# Altium project PHANTOM_VCU.PrjPcb (part 3 of 3)

## Sheet CAN.SchDoc
size A4; DocumentNumber: 6; SheetNumber: 6; SheetTotal: 8
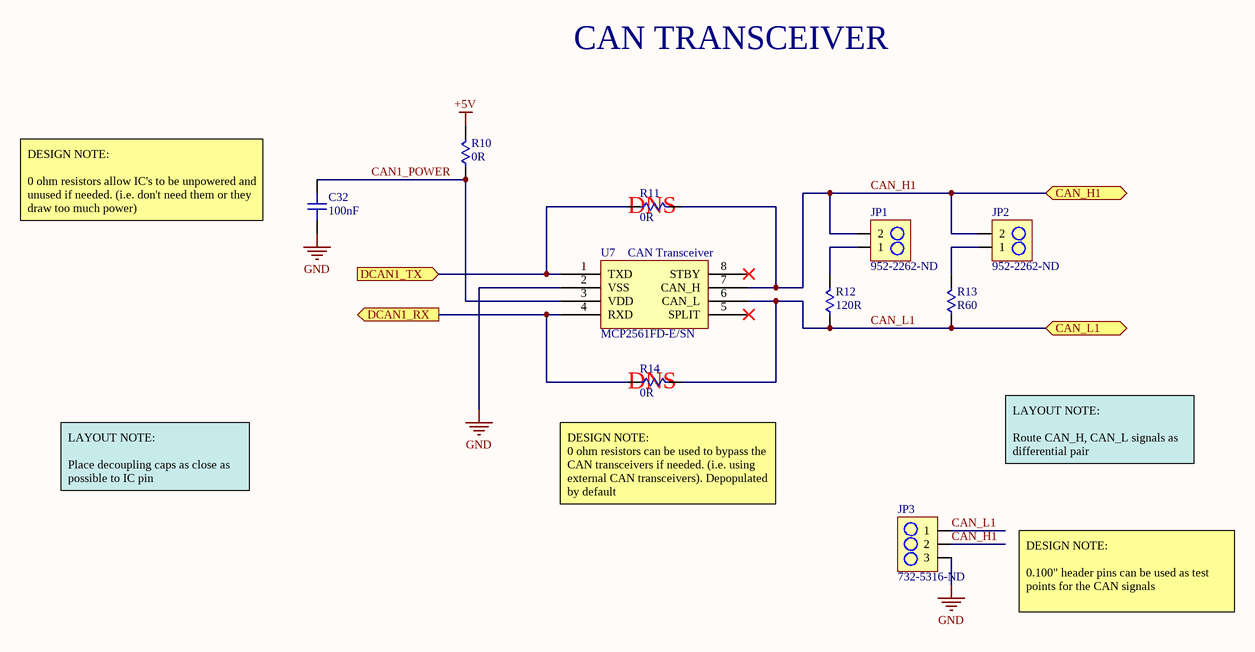
[diagram p6: CAN.SchDoc]

### Parts
C32  100nF  [C0402]
JP1  952-2262-ND  [2PIN_HEADER]
JP2  952-2262-ND  [2PIN_HEADER]
JP3  732-5316-ND  [3PIN_HEADER]
R10  0R  [R0402]
R11  0R  [R0402]
R12  120R  [R0402]
R13  R60  [R0402]
R14  0R  [R0402]
U7  MCP2561FD-E/SN  [8-SOIC_MCP2561]

### Ports
CAN_H1, CAN_L1, DCAN1_RX, DCAN1_TX

### Nets
+5V: R10.2
GND: C32.1 JP3.3 U7.2(VSS)
CAN1_POWER: C32.2 R10.1 U7.3(VDD)
CAN_H1: JP1.2 JP2.2 JP3.2 R11.2 U7.7(CAN_H) ; port CAN_H1
CAN_L1: JP3.1 R12.1 R13.1 R14.2 U7.6(CAN_L) ; port CAN_L1
DCAN1_RX: R14.1 U7.4(RXD) ; port DCAN1_RX
DCAN1_TX: R11.1 U7.1(TXD) ; port DCAN1_TX
NetJP1_1: JP1.1 R12.2
NetJP2_1: JP2.1 R13.2

Not connected (* = marked no-connect by the designer): U7 5(SPLIT)* 8(STBY)*

### Notes on the sheet
- CAN TRANSCEIVER
- DESIGN NOTE:
  0 ohm resistors allow IC's to be unpowered and unused if needed. (i.e. don't need them or they draw too much power)
- (near R11) DNS
- (near U7) CAN Transceiver
- (near R14) DNS
- LAYOUT NOTE:
  Place decoupling caps as close as possible to IC pin
- LAYOUT NOTE:
  Route CAN_H, CAN_L signals as differential pair
- (near R14) DESIGN NOTE:
  0 ohm resistors can be used to bypass the CAN transceivers if needed. (i.e. using external CAN transceivers). Depopulated by default
- DESIGN NOTE:
  0.100" header pins can be used as test points for the CAN signals

### Library data of the parts
C32 = CL05A104MP5NNNC: CAP MLCC 0.1uF 10V X5R 0402 20% SMD 0402 85C Paper T/R; Manufacturer: Samsung; Supplier 1: Digi-Key; Manufacturer Part Number: CL05A104MP5NNNC; Stock 1: 100000; Pricing 1: 1=0.1, 10=0.024, 100=0.0106, 500=0.0076, 1000=0.006, 2500=0.0054, 5000=0.005 (USD); Mount: Surface Mount; Case/Package: 0402; Case Code (Metric): 1005; Case Code (Imperial): 0402; Min Operating Temperature: -55°C; Max Operating Temperature: 85°C; Packaging: Tape and Reel; Capacitance: 100nF; Tolerance: 20%; Voltage Rating: 10V; Dielectric: X5R; Voltage Rating (DC): 10V; Length: 1mm; Height: 0.5mm; Width: 0.02inch; Thickness: 0.022inch; Depth: 0.5mm; Radiation Hardening: No; Lead Free: Lead Free; ComponentLink1URL: https://media.digikey.com/pdf/Data%20Sheets/Samsung%20PDFs/CL_Series_MLCC_ds.pdf; ComponentLink1Description: https://media.digikey.com/pdf/Data%20Sheets/Samsung%20PDFs/CL_Series_MLCC_ds.pdf; Supplier Part Number 1: 1276-1443-1-ND
JP1 JP2 = M20-9990246: CONN_HeaderPins2pos Headers & Wire Housings 02 SIL VERTICAL PIN HEADER TIN; Manufacturer: Harwin; Contact Resistance: 30mR; Max Current Rating: 3A; Number of Positions: 2; Gender: Male; Connector Type: Male Pin; Insulation Resistance: 10GR; Voltage Rating (AC): 750V; Pitch: 2.54mm; Supplier 1: Digi-Key; Manufacturer Part Number: M20-9990246; Stock 1: 53577; Pricing 1: 1=0.11, 10=0.099, 100=0.0609, 500=0.0504, 1000=0.0441, 5000=0.0378, 10000=0.0368 (USD); Case/Package: SIL; Colour: Black; Housing Colour: Black; Housing Material: Nylon; Contact Plating: Tin; Contact Material: Bronze,Brass; Min Operating Temperature: -40°C; Max Operating Temperature: 105°C; Package Quantity: 1000; Packaging: Bulk; Termination: Solder; Number of Rows: 1; Number of Contacts: 2; Orientation: Straight; Current Rating: 3A; Length: 5.08mm; Depth: 2.54mm; Contact Mating Length: 0.24inch; Radiation Hardening: No; REACH SVHC: No SVHC; ComponentLink1URL: https://datasheet.ciiva.com/8046/315376-8046930.pdf; ComponentLink1Description: https://datasheet.ciiva.com/8046/315376-8046930.pdf; ComponentLink2URL: https://datasheet.ciiva.com/6833/m20-999-6833368.pdf; ComponentLink2Description: https://datasheet.ciiva.com/6833/m20-999-6833368.pdf; ComponentLink3URL: https://datasheet.ciiva.com/11745/0900766b81034e61-11745755.pdf; ComponentLink3Description: https://datasheet.ciiva.com/11745/0900766b81034e61-11745755.pdf; ComponentLink4URL: https://datasheet.ciiva.com/22660/1830818-22660571.pdf; ComponentLink4Description: https://datasheet.ciiva.com/22660/1830818-22660571.pdf; ComponentLink5URL: https://datasheet.ciiva.com/26852/getdatasheetpartid-384170-26852203.pdf; ComponentLink5Description: https://datasheet.ciiva.com/26852/getdatasheetpartid-384170-26852203.pdf; Supplier Part Number 1: 952-2262-ND
JP3 = 61300311121: CONN_HeaderPins3pos WURTH ELEKTRONIK Board-To-Board Connector, Vertical, WR-PHD Series, Through Hole, Header, 3 Contacts, 2.54 mm; Manufacturer: Wurth Electronics; Number of Positions: 3; Gender: Male; Connector Type: Male Pin; Pitch: 0.1inch; Supplier 1: Digi-Key; Manufacturer Part Number: 61300311121; Stock 1: 57026; Pricing 1: 1=0.13, 10=0.106, 25=0.088, 50=0.074, 100=0.067, 1000=0.061 (USD); Mount: Through Hole; Case/Package: 100; Contact Plating: Gold; Contact Material: Copper; Colour: Black; Number of Rows: 1; Packaging: Bulk; Termination: Solder; Number of Contacts: 3; Contact Mating Length: 0.236inch; REACH SVHC: Unknown; Lead Free: Lead Free; ComponentLink1URL: http://www.farnell.com/cad/1737268.pdf; ComponentLink1Description: http://www.farnell.com/cad/1737268.pdf; Supplier Part Number 1: 732-5316-ND
R10 R11 R14 = RC0402JR-070RL: RES SMD 0 OHM 1/16W 0402; Manufacturer: Yageo; Resistance: 0mR; Power Rating: 62.5mW; Tolerance: 5%; Voltage Rating: 50V; Max Power Dissipation: 63mW; Temperature Coefficient: 200ppm/°C; Supplier 1: Digi-Key; Manufacturer Part Number: RC0402JR-070RL; Stock 1: 44333412; Pricing 1: 1=0.1, 10=0.017, 25=0.0124, 50=0.0096, 100=0.007, 250=0.0054, 500=0.0043, 1000=0.0032, 5000=0.0023 (USD); Case/Package: 0402; Contact Plating: Matte,Tin; Case Code (Metric): 1005; Case Code (Imperial): 0402; Min Operating Temperature: -55°C; Max Operating Temperature: 155°C; Packaging: Tape and Reel; Composition: Thick Film; Package Quantity: 1; Number of Terminations: 2; Termination: SMD/SMT; Military Standard: Not; Features: Moisture Resistant; Length: 1mm; Height: 0.016inch; Width: 0.02inch; Depth: 0.5mm; Radiation Hardening: No; REACH SVHC: Unknown; Lead Free: Lead Free; Supplier Part Number 1: 311-0.0JRCT-ND
R12 = RMCF0402JT120R: RES SMD 120 OHM 5% 0402 1/16W ±100ppm/C Molded SMD Paper T/R; Manufacturer: Stackpole Electronics; Power Rating: 62.5mW; Max Power Dissipation: 63mW; Temperature Coefficient: 100ppm/°C; Supplier 1: Digi-Key; Manufacturer Part Number: RMCF0402JT120R; Stock 1: 112024; Pricing 1: 1=0.1, 10=0.012, 100=0.005, 1000=0.0022, 2500=0.002, 5000=0.0016 (USD); Mount: Surface Mount; Case/Package: 0402; Case Code (Metric): 1005; Case Code (Imperial): 0402; Contact Plating: Matte,Tin; Min Operating Temperature: -55°C; Max Operating Temperature: 155°C; Tolerance: 5%; Packaging: Cut Tape; Resistance: 120R; Composition: Thick Film; Number of Terminations: 2; Features: Automotive AEC-Q200; Length: 0.039inch; Height: 0.016inch; Width: 0.02inch; Lead Free: Lead Free; Supplier Part Number 1: RMCF0402JT120RCT-ND
R13 = RMCF0402FT60R4: RES SMD 60.4 OHM 1% 0402 1/16W 100ppm/C Molded SMD SMD Paper T/R; Manufacturer: Stackpole Electronics; Resistance: 60.4R; Max Power Dissipation: 63mW; Temperature Coefficient: 100ppm/°C; Supplier 1: Digi-Key; Manufacturer Part Number: RMCF0402FT60R4; Stock 1: 29830; Pricing 1: 1=0.1, 10=0.016, 100=0.0064, 1000=0.0029, 2500=0.0025, 5000=0.0021 (USD); Mount: Surface Mount; Case/Package: 0402; Case Code (Metric): 1005; Case Code (Imperial): 0402; Contact Plating: Matte,Tin; Min Operating Temperature: -55°C; Max Operating Temperature: 155°C; Packaging: Tape and Reel; Tolerance: 1%; Composition: Thick Film; Number of Terminations: 2; Features: Automotive AEC-Q200; Length: 0.039inch; Height: 0.016inch; Width: 0.02inch; Radiation Hardening: No; Lead Free: Lead Free; Supplier Part Number 1: RMCF0402FT60R4CT-ND
U7 = MCP2561FD-E/SN: IC CAN Bus, Transceiver, CAN, 1, 1, 4.5 V, 5.5 V, SOIC; Manufacturer: Microchip; Number of Receivers: 1; Data Rate: 8Mbps; Min Supply Voltage: 4.5V; Max Supply Voltage: 5.5V; Max Supply Current: 70mA; Receiver Hysteresis: 200mV; Supplier 1: Digi-Key; Manufacturer Part Number: MCP2561FD-E/SN; Stock 1: 1072; Pricing 1: 1=0.97, 25=0.8084, 100=0.735 (USD); Case/Package: SOIC; Number of Pins: 8; Weight: 0.019048oz; Min Operating Temperature: -40°C; Max Operating Temperature: 125°C; Packaging: Rail/Tube; Number of Transceivers: 1; Logic Function: Transceiver; Interface: CAN; Number of Drivers: 1; Number of Transmit Buffers: 1; Number of Receive Buffers: 1; Operating Supply Current: 70mA; Package Quantity: 100; Length: 4.9mm; Height: 1.5mm; Width: 3.9mm; REACH SVHC: No SVHC; Lead Free: Lead Free; ComponentLink1URL: https://datasheet.ciiva.com/48512/mcp2561fd-eng-tds-48512069.pdf; ComponentLink1Description: https://datasheet.ciiva.com/48512/mcp2561fd-eng-tds-48512069.pdf; ComponentLink2URL: https://datasheet.ciiva.com/46406/1821190-46406024.pdf; ComponentLink2Description: https://datasheet.ciiva.com/46406/1821190-46406024.pdf; ComponentLink3URL: https://datasheet.ciiva.com/46406/1821190-46406056.pdf; ComponentLink3Description: https://datasheet.ciiva.com/46406/1821190-46406056.pdf; ComponentLink4URL: https://datasheet.ciiva.com/48473/20005284a-48473177.pdf; ComponentLink4Description: https://datasheet.ciiva.com/48473/20005284a-48473177.pdf

## Sheet Contactor_Switching.SchDoc
size A4; DocumentNumber: 7; SheetNumber: 7; SheetTotal: 8
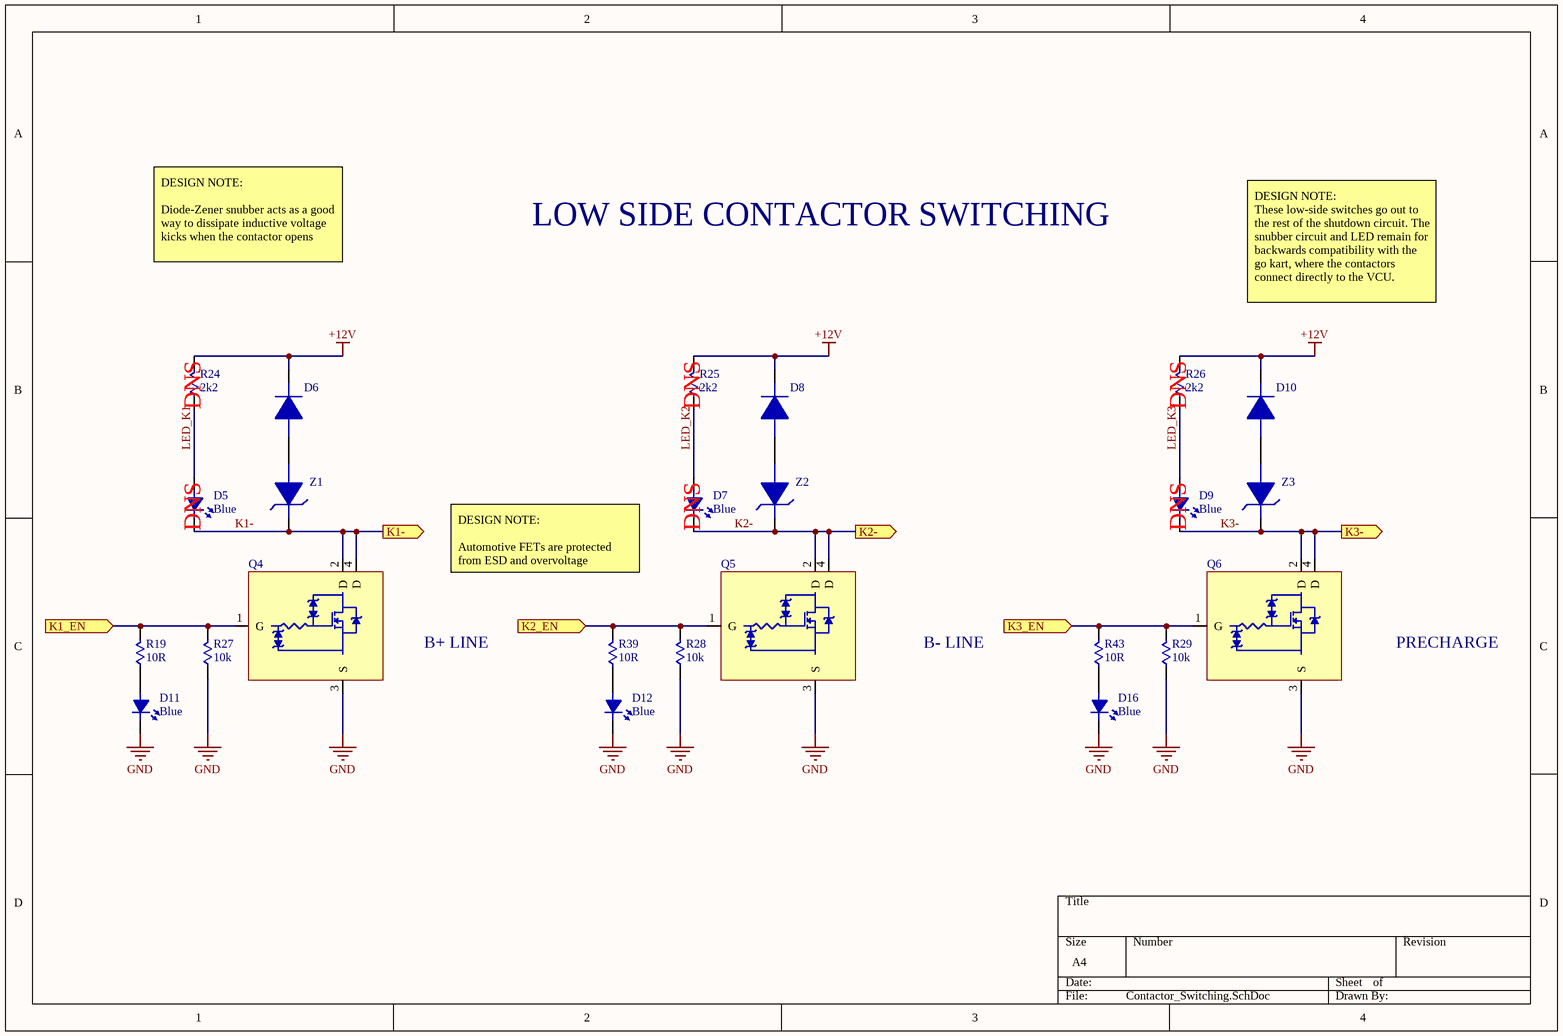
[diagram p7: Contactor_Switching.SchDoc]

### Parts
(Parts that share a designator on the sheet are numbered #1, #2 ... from top to bottom, then left to right.)
D5  Blue  [LED_0603]
D6  S3BB-TP  [DO-214AA_Diode]  (value not drawn)
D7  Blue  [LED_0603]
D8  S3BB-TP  [DO-214AA_Diode]  (value not drawn)
D9  Blue  [LED_0603]
D10  S3BB-TP  [DO-214AA_Diode]  (value not drawn)
D11  Blue  [LED_0603]
D12  Blue  [LED_0603]
D16  Blue  [LED_0603]
Q4  NCV8406ASTT1G  [SOT-223_NFET]  (value not drawn)
Q5  NCV8406ASTT1G  [SOT-223_NFET]  (value not drawn)
Q6  NCV8406ASTT1G  [SOT-223_NFET]  (value not drawn)
R19  10R  [R0402]
R24  2k2  [R0402]
R25  2k2  [R0402]
R26  2k2  [R0402]
R27  10k  [R0402]
R28  10k  [R0402]
R29  10k  [R0402]
R39#1  10R  [R0402]
R43#1  10R  [R0402]
Z1  12V  [DO-214AA_Diode]  (value not drawn)
Z2  12V  [DO-214AA_Diode]  (value not drawn)
Z3  12V  [DO-214AA_Diode]  (value not drawn)

### Ports
K1-, K1_EN, K2-, K2_EN, K3-, K3_EN

### Nets
+12V: D6.2 D8.2 D10.2 R24.2 R25.2 R26.2
GND: D11.2 D12.2 D16.2 Q4.3(S) Q5.3(S) Q6.3(S) R27.1 R28.1 R29.1
K1-: D5.2 Q4.2(D) Q4.4(D) Z1.2 ; port K1-
K1_EN: Q4.1(G) R19.2 R27.2 ; port K1_EN
K2-: D7.2 Q5.2(D) Q5.4(D) Z2.2 ; port K2-
K2_EN: Q5.1(G) R28.2 R39#1.2 ; port K2_EN
K3-: D9.2 Q6.2(D) Q6.4(D) Z3.2 ; port K3-
K3_EN: Q6.1(G) R29.2 R43#1.2 ; port K3_EN
LED_K1: D5.1 R24.1
LED_K2: D7.1 R25.1
LED_K3: D9.1 R26.1
NetD6_1: D6.1 Z1.1
NetD8_1: D8.1 Z2.1
NetD10_1: D10.1 Z3.1
NetD11_1: D11.1 R19.1
NetD12_1: D12.1 R39#1.1
NetD16_1: D16.1 R43#1.1

### Notes on the sheet
- LOW SIDE CONTACTOR SWITCHING
- DESIGN NOTE:
  Diode-Zener snubber acts as a good way to dissipate inductive voltage kicks when the contactor opens
- DESIGN NOTE:
  These low-side switches go out to the rest of the shutdown circuit. The snubber circuit and LED remain for backwards compatibility with the go kart, where the contactors connect directly to the VCU.
- (near R24) DNS
- (near R25) DNS
- (near R26) DNS
- (near D5) DNS
- DESIGN NOTE:
  Automotive FETs are protected from ESD and overvoltage
- (near D7) DNS
- (near D9) DNS
- B+ LINE
- B- LINE
- PRECHARGE

### Library data of the parts
D5 D7 D9 D11 D12 D16 = 150060BS75000: LED BLUE CLEAR 0603 SMD 3.2V 145MCD, 470NM; Manufacturer: Wurth Electronics; Forward Current: 30mA; Viewing Angle: 140°; Lens Style: Clear,Rectangular; Test Current: 20mA; Supplier 1: Digi-Key; Manufacturer Part Number: 150060BS75000; Stock 1: 59667; Pricing 1: 1=0.15, 50=0.141, 100=0.121, 500=0.104 (USD); Mount: Surface Mount; Case/Package: 0603; Color: Blue; Case Code (Metric): 1608; Case Code (Imperial): 0603; Min Operating Temperature: -40°C; Max Operating Temperature: 85°C; Luminous Intensity: 145mcd; Forward Voltage: 3.2V; Wavelength: 470nm; Package Quantity: 4000; Packaging: Cut Tape; Dominant Wavelength: 470nm; Length: 1.6mm; Height: 0.7mm; Width: 0.8mm; REACH SVHC: Unknown; ComponentLink1URL: https://www.distrelec.biz/Web/Downloads/_t/ds/150060BS75000_eng_tds.pdf?mime=application%2Fpdf; ComponentLink1Description: https://www.distrelec.biz/Web/Downloads/_t/ds/150060BS75000_eng_tds.pdf?mime=application%2Fpdf; ComponentLink2URL: https://katalog.we-online.de/led/datasheet/150060BS75000.pdf; ComponentLink2Description: https://katalog.we-online.de/led/datasheet/150060BS75000.pdf; ComponentLink3URL: http://www.farnell.com/datasheets/1911343.pdf; ComponentLink3Description: http://www.farnell.com/datasheets/1911343.pdf; ComponentLink4URL: http://www.produktinfo.conrad.com/datenblaetter/750000-774999/759426-da-01-en-CHIPLED_0603_W_KL_BLAU_150060BS75000.pdf; ComponentLink4Description: http://www.produktinfo.conrad.com/datenblaetter/750000-774999/759426-da-01-en-CHIPLED_0603_W_KL_BLAU_150060BS75000.pdf; Supplier Part Number 1: 732-4966-1-ND
D6 D8 D10 = S3BB-TP: DIODE GEN PURP 100V 3A DO214AA; Manufacturer: MCC; Max Surge Current: 100A; Forward Voltage: 1.15V; Peak Reverse Current: 10uA; Element Configuration: Single; Supplier 1: Digi-Key; Manufacturer Part Number: S3BB-TP; Stock 1: 10943; Pricing 1: 1=0.56, 10=0.441, 25=0.372, 100=0.3028, 250=0.2509, 500=0.2076, 1000=0.1557 (USD); Mount: Surface Mount; Number of Pins: 2; Packaging: Tape and Reel; Package Quantity: 1; Reverse Voltage (DC): 100V; Average Rectified Current: 3A; Peak Non-Repetitive Surge Current: 100A; Max Repetitive Reverse Voltage (Vrrm): 100V; Radiation Hardening: No; Lead Free: Lead Free; ComponentLink1URL: https://datasheet.ciiva.com/914/s3ab-s3mbsmb-914278.pdf; ComponentLink1Description: https://datasheet.ciiva.com/914/s3ab-s3mbsmb-914278.pdf; ComponentLink2URL: https://datasheet.ciiva.com/914/s3ab-s3mbsmb-914279.pdf; ComponentLink2Description: https://datasheet.ciiva.com/914/s3ab-s3mbsmb-914279.pdf; ComponentLink3URL: https://datasheet.ciiva.com/914/s3ab-s3mbsmb-914280.pdf; ComponentLink3Description: https://datasheet.ciiva.com/914/s3ab-s3mbsmb-914280.pdf; ComponentLink4URL: https://datasheet.ciiva.com/15200/getdatasheetpartid-686538-15200554.pdf; ComponentLink4Description: https://datasheet.ciiva.com/15200/getdatasheetpartid-686538-15200554.pdf; ComponentLink5URL: https://datasheet.ciiva.com/17437/s3ab-s3mbsmb-17437836.pdf; ComponentLink5Description: https://datasheet.ciiva.com/17437/s3ab-s3mbsmb-17437836.pdf; Supplier Part Number 1: S3BB-TPMSCT-ND
Q4-Q6 = NCV8406ASTT1G: MOSFET Self-Protected Low Side Driver Automotive 4-Pin(3+Tab) SOT-223 T/R; Manufacturer: ON Semiconductor; Number of Outputs: 1; Max Output Current: 7A; Interface: On/Off; On-State Resistance: 210mR; Fault Protection: Over Voltage,Over Temperature; Supplier 1: Digi-Key; Manufacturer Part Number: NCV8406ASTT1G; Stock 1: 277; Pricing 1: 1=1.41, 10=1.258, 100=0.981, 500=0.8104 (USD); Mount: Surface Mount; Case/Package: TO-261-4; Number of Pins: 4; Min Operating Temperature: -40°C; Max Operating Temperature: 150°C; Packaging: Tape and Reel; Package Quantity: 1000; Length: 6.5mm; Height: 1.57mm; Radiation Hardening: No; Lead Free: Lead Free; Halogen Free: Halogen Free; ComponentLink1URL: https://datasheet.ciiva.com/15265/htmls5-15265281.pdf; ComponentLink1Description: https://datasheet.ciiva.com/15265/htmls5-15265281.pdf; ComponentLink2URL: https://datasheet.ciiva.com/1956/ncv8406-d-1956280.pdf; ComponentLink2Description: https://datasheet.ciiva.com/1956/ncv8406-d-1956280.pdf; ComponentLink3URL: https://datasheet.ciiva.com/16217/ncv8406-d-16217275.pdf; ComponentLink3Description: https://datasheet.ciiva.com/16217/ncv8406-d-16217275.pdf; Supplier Part Number 1: NCV8406ASTT1GOSDKR-ND
R19 R39#1 R43#1 = RC0402JR-0710RL: RES SMD 10 OHM 5% 1/16W 0402; Manufacturer: Yageo; Power Rating: 63mW; Voltage Rating: 50V; Temperature Coefficient: 200ppm/°C; Supplier 1: Digi-Key; Manufacturer Part Number: RC0402JR-0710RL; Stock 1: 2958453; Pricing 1: 1=0.1, 10=0.019, 100=0.0079, 1000=0.0036, 2500=0.0031, 5000=0.0026 (USD); Case/Package: 0402; Case Code (Imperial): 0402; Case Code (Metric): 1005; Min Operating Temperature: -55°C; Max Operating Temperature: 155°C; Resistance: 10R; Tolerance: 5%; Packaging: Tape and Reel; Termination: SMD/SMT; Composition: Thick Film; Military Standard: Not; Package Quantity: 1; Number of Terminations: 2; Max Power Dissipation: 63mW; Working Voltage: 50V; Features: Moisture Resistant; Length: 1mm; Height: 0.016inch; Depth: 0.5mm; Width: 0.02inch; REACH SVHC: Unknown; Lead Free: Lead Free; ComponentLink1URL: http://www.farnell.com/datasheets/1018594.pdf; ComponentLink1Description: http://www.farnell.com/datasheets/1018594.pdf; ComponentLink2URL: http://www.yageo.com/documents/recent/PYu-RC_Group_51_RoHS_L_10.pdf; ComponentLink2Description: http://www.yageo.com/documents/recent/PYu-RC_Group_51_RoHS_L_10.pdf; ComponentLink3URL: http://www.yageo.com/documents/recent/PYu-RC0402_51_RoHS_L_6_r.pdf; ComponentLink3Description: http://www.yageo.com/documents/recent/PYu-RC0402_51_RoHS_L_6_r.pdf; Supplier Part Number 1: 311-10JRCT-ND
R24-R26 = RC0402JR-072K2L: RES SMD 2.2K OHM 5% 1/16W 0402; Manufacturer: Yageo; Resistance: 2.2kR; Power Rating: 63mW; Voltage Rating: 50V; Temperature Coefficient: 100ppm/°C; Supplier 1: Digi-Key; Manufacturer Part Number: RC0402JR-072K2L; Stock 1: 7890813; Pricing 1: 1=0.1, 10=0.018, 100=0.0073, 1000=0.0033, 2500=0.0029, 5000=0.0024 (USD); Case/Package: 0402; Weight: 2.3E-05oz; Case Code (Metric): 1005; Case Code (Imperial): 0402; Min Operating Temperature: -55°C; Max Operating Temperature: 155°C; Tolerance: 5%; Packaging: Tape and Reel; Composition: Thick Film; Termination: SMD/SMT; Military Standard: Not; Package Quantity: 1; Number of Terminations: 2; Max Power Dissipation: 63mW; Working Voltage: 50V; Features: Moisture Resistant; Length: 1mm; Height: 0.016inch; Depth: 0.5mm; Width: 0.02inch; REACH SVHC: Unknown; Lead Free: Lead Free; Supplier Part Number 1: 311-2.2KJRCT-ND
R27-R29 = RC0402JR-0710KL: RES SMD 10K OHM 5% 1/16W 0402; Manufacturer: Yageo; Resistance: 10kR; Power Rating: 62.5mW; Voltage Rating: 50V; Temperature Coefficient: 100ppm/°C; Max Power Dissipation: 63mW; Supplier 1: Digi-Key; Manufacturer Part Number: RC0402JR-0710KL; Stock 1: 47303622; Pricing 1: 1=0.1, 10=0.018, 100=0.0073, 1000=0.0033, 2500=0.0029, 5000=0.0024 (USD); Case/Package: 0402; Case Code (Metric): 1005; Case Code (Imperial): 0402; Min Operating Temperature: -55°C; Max Operating Temperature: 155°C; Packaging: Tape and Reel; Tolerance: 5%; Package Quantity: 1; Composition: Thick Film; Number of Terminations: 2; Termination: SMD/SMT; Military Standard: Not; Features: Moisture Resistant; Length: 1mm; Height: 0.016inch; Width: 0.02inch; Depth: 0.5mm; REACH SVHC: Unknown; Lead Free: Lead Free; Supplier Part Number 1: 311-10KJRCT-ND
Z1-Z3 = SMBJ5349B-TP: DIODE ZENER 12V 5W DO214AA; Manufacturer: MCC; Tolerance: 5%; Forward Voltage: 1.2V; Max Reverse Leakage Current: 2uA; Impedance: 2.5R; Zener Current: 395mA; Test Current: 100mA; Element Configuration: Single; Supplier 1: Digi-Key; Manufacturer Part Number: SMBJ5349B-TP; Stock 1: 41768; Pricing 1: 1=0.65, 10=0.57, 25=0.5044, 100=0.4394, 250=0.3824, 500=0.3255, 1000=0.2604 (USD); Mount: Surface Mount; Case/Package: SMB; Number of Pins: 2; Min Operating Temperature: -55°C; Max Operating Temperature: 150°C; Package Quantity: 3000; Packaging: Tape and Reel; Power Dissipation: 5W; Zener Voltage: 12V; Voltage Tolerance: 5%; Max Power Dissipation: 5W; Working Voltage: 12V; Peak Reverse Current: 2uA; Radiation Hardening: No; Lead Free: Lead Free; ComponentLink1URL: https://datasheet.ciiva.com/894/smbj5338b-smbj5388bsmb-894182.pdf; ComponentLink1Description: https://datasheet.ciiva.com/894/smbj5338b-smbj5388bsmb-894182.pdf; ComponentLink2URL: https://datasheet.ciiva.com/894/smbj5338b-smbj5388bsmb-894183.pdf; ComponentLink2Description: https://datasheet.ciiva.com/894/smbj5338b-smbj5388bsmb-894183.pdf; ComponentLink3URL: https://datasheet.ciiva.com/894/smbj5338b-smbj5388bsmb-894184.pdf; ComponentLink3Description: https://datasheet.ciiva.com/894/smbj5338b-smbj5388bsmb-894184.pdf; ComponentLink4URL: https://datasheet.ciiva.com/17444/smbj5338b-smbj5388bsmb-17444298.pdf; ComponentLink4Description: https://datasheet.ciiva.com/17444/smbj5338b-smbj5388bsmb-17444298.pdf; ComponentLink5URL: https://datasheet.ciiva.com/26844/getdatasheetpartid-147575-26844923.pdf; ComponentLink5Description: https://datasheet.ciiva.com/26844/getdatasheetpartid-147575-26844923.pdf; Supplier Part Number 1: SMBJ5349B-TPMSDKR-ND

## Sheet ADC_Decoupling.SchDoc
size A4; DocumentNumber: 8; SheetNumber: 8; SheetTotal: 8
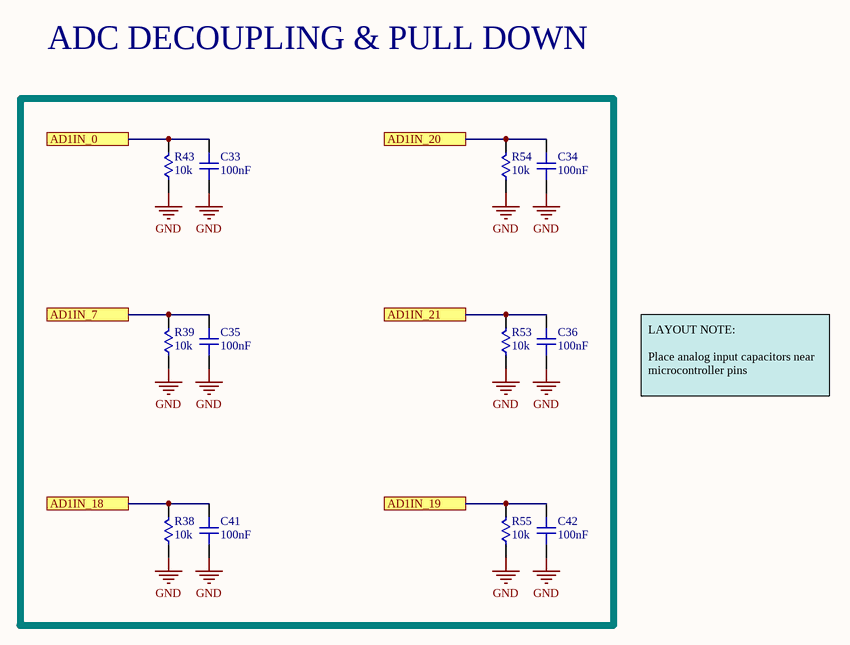
[diagram p8: ADC_Decoupling.SchDoc]

### Parts
(Parts that share a designator on the sheet are numbered #1, #2 ... from top to bottom, then left to right.)
C33  100nF  [C0402]
C34  100nF  [C0402]
C35  100nF  [C0402]
C36  100nF  [C0402]
C41  100nF  [C0402]
C42  100nF  [C0402]
R38#2  10k  [R0402]
R39#2  10k  [R0402]
R43#2  10k  [R0402]
R53  10k  [R0402]
R54  10k  [R0402]
R55  10k  [R0402]

### Ports
AD1IN_0, AD1IN_7, AD1IN_18, AD1IN_19, AD1IN_20, AD1IN_21

### Nets
GND: C33.1 C34.1 C35.1 C36.1 C41.1 C42.1 R38#2.1 R39#2.1 R43#2.1 R53.1 R54.1 R55.1
AD1IN_0: C33.2 R43#2.2 ; port AD1IN_0
AD1IN_7: C35.2 R39#2.2 ; port AD1IN_7
AD1IN_18: C41.2 R38#2.2 ; port AD1IN_18
AD1IN_19: C42.2 R55.2 ; port AD1IN_19
AD1IN_20: C34.2 R54.2 ; port AD1IN_20
AD1IN_21: C36.2 R53.2 ; port AD1IN_21

### Notes on the sheet
- ADC DECOUPLING & PULL DOWN
- LAYOUT NOTE:
  Place analog input capacitors near microcontroller pins

### Library data of the parts
C33-C36 C41 C42 = CL05A104MP5NNNC: as C32 on sheet CAN; Supplier 1: Digi-Key; Manufacturer Part Number: CL05A104MP5NNNC; Stock 1: 100000; Pricing 1: 1=0.1, 10=0.024, 100=0.0106, 500=0.0076, 1000=0.006, 2500=0.0054, 5000=0.005 (USD); Mount: Surface Mount; Case/Package: 0402; Case Code (Metric): 1005; Case Code (Imperial): 0402; Min Operating Temperature: -55°C; Max Operating Temperature: 85°C; Packaging: Tape and Reel; Capacitance: 100nF; Tolerance: 20%; Voltage Rating: 10V; Dielectric: X5R; Voltage Rating (DC): 10V; Length: 1mm; Height: 0.5mm; Width: 0.02inch; Thickness: 0.022inch; Depth: 0.5mm; Radiation Hardening: No; Lead Free: Lead Free; ComponentLink1URL: https://media.digikey.com/pdf/Data%20Sheets/Samsung%20PDFs/CL_Series_MLCC_ds.pdf; ComponentLink1Description: https://media.digikey.com/pdf/Data%20Sheets/Samsung%20PDFs/CL_Series_MLCC_ds.pdf; Supplier Part Number 1: 1276-1443-1-ND
R38#2 R39#2 R43#2 R53-R55 = RC0402JR-0710KL: as R27 on sheet Contactor_Switching; Supplier 1: Digi-Key; Manufacturer Part Number: RC0402JR-0710KL; Stock 1: 47303622; Pricing 1: 1=0.1, 10=0.018, 100=0.0073, 1000=0.0033, 2500=0.0029, 5000=0.0024 (USD); Case/Package: 0402; Case Code (Metric): 1005; Case Code (Imperial): 0402; Min Operating Temperature: -55°C; Max Operating Temperature: 155°C; Packaging: Tape and Reel; Tolerance: 5%; Package Quantity: 1; Composition: Thick Film; Number of Terminations: 2; Termination: SMD/SMT; Military Standard: Not; Features: Moisture Resistant; Length: 1mm; Height: 0.016inch; Width: 0.02inch; Depth: 0.5mm; REACH SVHC: Unknown; Lead Free: Lead Free; Supplier Part Number 1: 311-10KJRCT-ND

## Sheet DAC.SchDoc
size A4
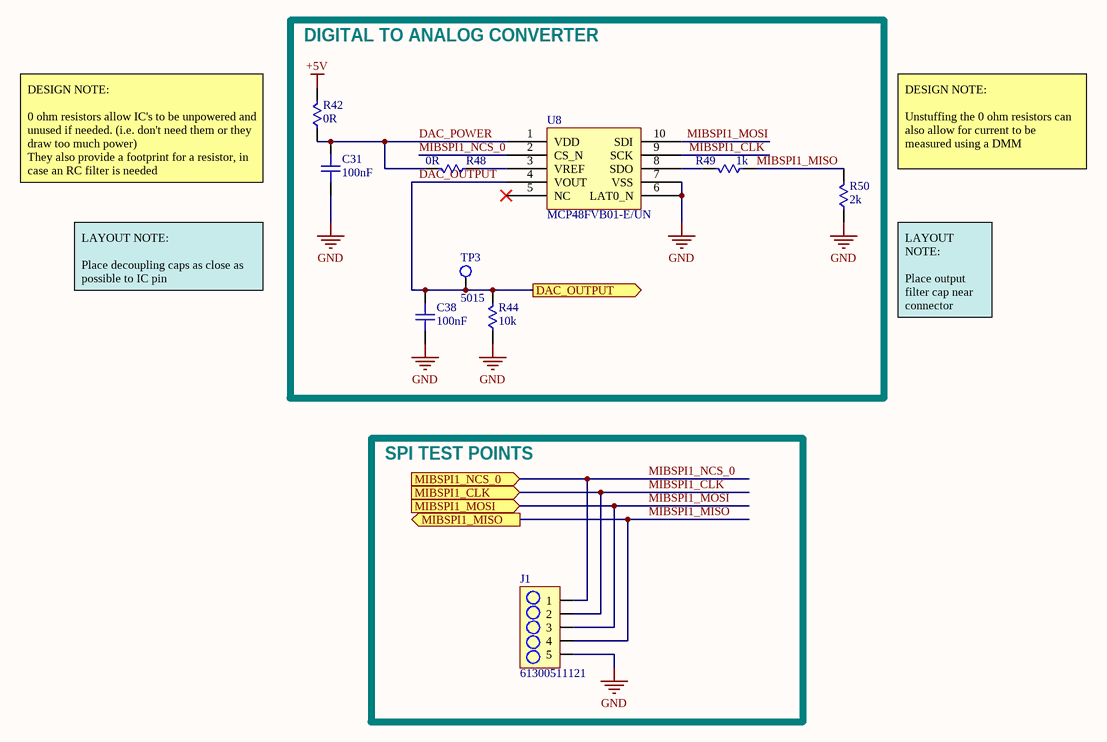
[diagram p9: DAC.SchDoc]

### Parts
C31  100nF  [C0402]
C38  100nF  [C0402]
J1  61300511121  [5PIN_HEADER]
R42  0R  [R0402]
R44  10k  [R0402]
R48  0R  [R0402]
R49  1k  [R0402]
R50  2k  [R0402]
TP3  5015  [TP_HOOK]
U8  MCP48FVB01-E/UN  [MSSOP-10]

### Blocks framed on the sheet
DIGITAL TO ANALOG CONVERTER: C31 C38 R42 R44 R48-R50 TP3 U8
SPI TEST POINTS: J1

### Ports
DAC_OUTPUT, MIBSPI1_CLK, MIBSPI1_MISO, MIBSPI1_MOSI, MIBSPI1_NCS_0

### Nets
+5V: R42.2
GND: C31.1 C38.1 J1.5 R44.1 R50.1 U8.6(LAT0_N) U8.7(VSS)
DAC_OUTPUT: C38.2 R44.2 TP3.1 U8.4(VOUT) ; port DAC_OUTPUT
DAC_POWER: C31.2 R42.1 R48.2 U8.1(VDD)
MIBSPI1_CLK: J1.2 U8.9(SCK) ; port MIBSPI1_CLK
MIBSPI1_MISO: J1.4 R49.1 R50.2 ; port MIBSPI1_MISO
MIBSPI1_MOSI: J1.3 U8.10(SDI) ; port MIBSPI1_MOSI
MIBSPI1_NCS_0: J1.1 U8.2(CS_N) ; port MIBSPI1_NCS_0
NetR48_1: R48.1 U8.3(VREF)
NetR49_2: R49.2 U8.8(SDO)

Not connected (* = marked no-connect by the designer): U8 5(NC)*

### Notes on the sheet
- DESIGN NOTE:
  0 ohm resistors allow IC's to be unpowered and unused if needed. (i.e. don't need them or they draw too much power)
  They also provide a footprint for a resistor, in case an RC filter is needed
- DESIGN NOTE:
  Unstuffing the 0 ohm resistors can also allow for current to be measured using a DMM
- LAYOUT NOTE:
  Place decoupling caps as close as possible to IC pin
- LAYOUT NOTE:
  Place output filter cap near connector

### Library data of the parts
C31 C38 = CL05A104MP5NNNC: as C32 on sheet CAN; Supplier 1: Digi-Key; Manufacturer Part Number: CL05A104MP5NNNC; Stock 1: 100000; Pricing 1: 1=0.1, 10=0.024, 100=0.0106, 500=0.0076, 1000=0.006, 2500=0.0054, 5000=0.005 (USD); Mount: Surface Mount; Case/Package: 0402; Case Code (Metric): 1005; Case Code (Imperial): 0402; Min Operating Temperature: -55°C; Max Operating Temperature: 85°C; Packaging: Tape and Reel; Capacitance: 100nF; Tolerance: 20%; Voltage Rating: 10V; Dielectric: X5R; Voltage Rating (DC): 10V; Length: 1mm; Height: 0.5mm; Width: 0.02inch; Thickness: 0.022inch; Depth: 0.5mm; Radiation Hardening: No; Lead Free: Lead Free; ComponentLink1URL: https://media.digikey.com/pdf/Data%20Sheets/Samsung%20PDFs/CL_Series_MLCC_ds.pdf; ComponentLink1Description: https://media.digikey.com/pdf/Data%20Sheets/Samsung%20PDFs/CL_Series_MLCC_ds.pdf; Supplier Part Number 1: 1276-1443-1-ND
J1 = 61300511121: CONN_HeaderPins5pos WURTH ELEKTRONIK         61300511121            Board-To-Board Connector, Vertical, WR-PHD Series, Through Hole, Header, 5 Contacts, 2.54 mm; Manufacturer: Wurth Electronics; Number of Positions: 5; Gender: Male; Connector Type: Male Pin; Pitch: 0.1inch; Supplier 1: Digi-Key; Manufacturer Part Number: 61300511121; Stock 1: 20896; Pricing 1: 1=0.25, 10=0.209, 25=0.174, 50=0.145, 100=0.132, 1000=0.12 (USD); Mount: Through Hole; Contact Plating: Gold; Contact Material: Copper; Color: Black; Number of Rows: 1; Packaging: Bulk; Termination: Solder; Number of Contacts: 5; Contact Mating Length: 0.236inch; REACH SVHC: Unknown; Lead Free: Lead Free; Supplier Part Number 1: 732-5318-ND
R42 R48 = RC0402JR-070RL: as R10 on sheet CAN; Supplier 1: Digi-Key; Manufacturer Part Number: RC0402JR-070RL; Stock 1: 44333412; Pricing 1: 1=0.1, 10=0.017, 25=0.0124, 50=0.0096, 100=0.007, 250=0.0054, 500=0.0043, 1000=0.0032, 5000=0.0023 (USD); Case/Package: 0402; Contact Plating: Matte,Tin; Case Code (Metric): 1005; Case Code (Imperial): 0402; Min Operating Temperature: -55°C; Max Operating Temperature: 155°C; Packaging: Tape and Reel; Composition: Thick Film; Package Quantity: 1; Number of Terminations: 2; Termination: SMD/SMT; Military Standard: Not; Features: Moisture Resistant; Length: 1mm; Height: 0.016inch; Width: 0.02inch; Depth: 0.5mm; Radiation Hardening: No; REACH SVHC: Unknown; Lead Free: Lead Free; Supplier Part Number 1: 311-0.0JRCT-ND
R44 = RC0402JR-0710KL: as R27 on sheet Contactor_Switching; Supplier 1: Digi-Key; Manufacturer Part Number: RC0402JR-0710KL; Stock 1: 47303622; Pricing 1: 1=0.1, 10=0.018, 100=0.0073, 1000=0.0033, 2500=0.0029, 5000=0.0024 (USD); Case/Package: 0402; Case Code (Metric): 1005; Case Code (Imperial): 0402; Min Operating Temperature: -55°C; Max Operating Temperature: 155°C; Packaging: Tape and Reel; Tolerance: 5%; Package Quantity: 1; Composition: Thick Film; Number of Terminations: 2; Termination: SMD/SMT; Military Standard: Not; Features: Moisture Resistant; Length: 1mm; Height: 0.016inch; Width: 0.02inch; Depth: 0.5mm; REACH SVHC: Unknown; Lead Free: Lead Free; Supplier Part Number 1: 311-10KJRCT-ND
R49 = RR0510P-102-D: RES SMD 1K OHM 0.5% 1/16W 0402; Manufacturer: Susumu; Resistance: 1kR; Power Rating: 63mW; Voltage Rating: 25V; Temperature Coefficient: 25ppm/°C; Supplier 1: Digi-Key; Manufacturer Part Number: RR0510P-102-D; Stock 1: 721157; Pricing 1: 1=0.1, 10=0.074, 100=0.0285, 1000=0.0125, 2500=0.0108, 5000=0.0097 (USD); Case/Package: 0402; Number of Pins: 2; Case Code (Metric): 1005; Case Code (Imperial): 0402; Min Operating Temperature: -55°C; Max Operating Temperature: 125°C; Package Quantity: 1; Tolerance: 0.5%; Packaging: Tape and Reel; Composition: Thin Film; Number of Terminations: 2; Termination: SMD/SMT; Max Power Dissipation: 63mW; Voltage Rating (DC): 25V; Length: 0.039inch; Height: 0.016inch; Width: 0.02inch; REACH SVHC: Unknown; Lead Free: Lead Free; ComponentLink1URL: http://www.susumu.co.jp/common/pdf/n_catalog_partition05_en.pdf; ComponentLink1Description: http://www.susumu.co.jp/common/pdf/n_catalog_partition05_en.pdf; ComponentLink2URL: http://www.farnell.com/datasheets/1581132.pdf; ComponentLink2Description: http://www.farnell.com/datasheets/1581132.pdf; Supplier Part Number 1: RR05P1.0KDCT-ND
R50 = RC0402FR-072KL: RES SMD 2K OHM 1% 1/16W 0402; Manufacturer: Yageo; Resistance: 2kR; Power Rating: 63mW; Voltage Rating: 50V; Temperature Coefficient: 100ppm/°C; Supplier 1: Digi-Key; Manufacturer Part Number: RC0402FR-072KL; Stock 1: 12787794; Pricing 1: 1=0.1, 10=0.016, 100=0.0067, 1000=0.003, 2500=0.0026, 5000=0.0022 (USD); Case/Package: 0402; Case Code (Metric): 1005; Case Code (Imperial): 0402; Min Operating Temperature: -55°C; Max Operating Temperature: 155°C; Tolerance: 1%; Package Quantity: 1; Packaging: Tape and Reel; Composition: Thick Film; Number of Terminations: 2; Termination: SMD/SMT; Military Standard: Not; Max Power Dissipation: 63mW; Voltage Rating (DC): 50V; Working Voltage: 50V; Features: Moisture Resistant; Length: 1mm; Height: 0.016inch; Width: 0.02inch; Depth: 0.5mm; REACH SVHC: Unknown; Lead Free: Lead Free; ComponentLink1URL: http://www.yageo.com/documents/recent/PYu-RC_Group_51_RoHS_L_10.pdf?src-supplier=Digi-Key; ComponentLink1Description: http://www.yageo.com/documents/recent/PYu-RC_Group_51_RoHS_L_10.pdf?src-supplier=Digi-Key; ComponentLink2URL: http://documents.rs-components.com/techlib://itc_doclist_GB.htm?stockno=6186510&src-supplier=RSComponents; ComponentLink2Description: http://documents.rs-components.com/techlib://itc_doclist_GB.htm?stockno=6186510&src-supplier=RSComponents; ComponentLink3URL: https://www.verical.com/server-webapp/html/getDatasheet?partID=358921&src-supplier=Verical; ComponentLink3Description: https://www.verical.com/server-webapp/html/getDatasheet?partID=358921&src-supplier=Verical; ComponentLink4URL: http://www.mouser.com/ds/2/447/PYu-RC0402_51_RoHS_L_6_r-8721.pdf?src-supplier=Mouser; ComponentLink4Description: http://www.mouser.com/ds/2/447/PYu-RC0402_51_RoHS_L_6_r-8721.pdf?src-supplier=Mouser; ComponentLink5URL: http://www.farnell.com/datasheets/1018594.pdf?src-supplier=Element14; ComponentLink5Description: http://www.farnell.com/datasheets/1018594.pdf?src-supplier=Element14; ComponentLink6URL: http://www.farnell.com/datasheets/2167052.pdf?src-supplier=Element14; ComponentLink6Description: http://www.farnell.com/datasheets/2167052.pdf?src-supplier=Element14; Supplier Part Number 1: 311-2KLRCT-ND
TP3 = 5015: TEST POINT, PCB, SMT; Manufacturer: Keystone Electronics; Number of Ports: 1; Supplier 1: Digi-Key; Manufacturer Part Number: 5015; Stock 1: 1937775; Pricing 1: 1=0.44, 10=0.421, 25=0.3604, 50=0.3064, 100=0.2944, 250=0.2644, 500=0.2524 (USD); Mount: Surface Mount; Colour: White; Contact Material: Bronze; Contact Plating: Tin,Silver,Lead; Material: Bronze,Silver; Package Quantity: 1; Packaging: Tape and Reel; Termination: Solder; Orientation: Straight; Length: 2.66mm; Height: 0.06inch; Thickness: 0.01inch; Depth: 1.01mm; REACH SVHC: No SVHC; Lead Free: Lead Free; ComponentLink1URL: https://datasheet.ciiva.com/2917/5015-2917616.pdf; ComponentLink1Description: https://datasheet.ciiva.com/2917/5015-2917616.pdf; ComponentLink2URL: https://datasheet.ciiva.com/2917/5015-2917617.pdf; ComponentLink2Description: https://datasheet.ciiva.com/2917/5015-2917617.pdf; ComponentLink3URL: https://datasheet.ciiva.com/1123/5015-1123862.pdf; ComponentLink3Description: https://datasheet.ciiva.com/1123/5015-1123862.pdf; ComponentLink4URL: https://datasheet.ciiva.com/16883/70182998-16883734.pdf; ComponentLink4Description: https://datasheet.ciiva.com/16883/70182998-16883734.pdf; Supplier Part Number 1: 36-5015CT-ND
U8 = MCP48FVB01-E/UN: IC DAC 8BIT V-OUT BUFF 10-MSOP; Manufacturer: Microchip; Number of Bits: 8; Number of D/A Converters: 1; Settling Time: 7.8us; Differential Output: No; Interface: SPI; Resolution: 8b; Supplier 1: Digi-Key; Manufacturer Part Number: MCP48FVB01-E/UN; Stock 1: 213; Pricing 1: 1=0.7, 25=0.5872, 100=0.5356 (USD); Case/Package: MSOP; Number of Pins: 10; Min Operating Temperature: -40°C; Max Operating Temperature: 125°C; Packaging: Rail/Tube; REACH SVHC: No SVHC; Supplier Part Number 1: MCP48FVB01-E/UN-ND

## Nets that join several sheets
+3V3: Connectors (R18.2 X4.2 X4.10), Power_Sensing (C1.2 R3.2 R4.2 U1.6), BUCK_CONVERTERS (6 pins), Power_MCU (17 pins), VCU_Schematic (D14.4 R6.2 R7.2), MCU_Signals (6 pins)
+5V: Connectors (5 pins), Power_Sensing (7 pins), BUCK_CONVERTERS (5 pins), VCU_Schematic (R37.2 R38#1.2), MCU_Signals (C25.2 U5.66 U5.69), CAN (R10.2), DAC (R42.2)
+5V_BAT: Power_Sensing (C28.1 U6.8), BUCK_CONVERTERS (5 pins)
+5V_USB: Power_Sensing (C29.2 U6.6), MCU_Signals (5 pins)
+12V: Connectors (6 pins), Power_Sensing (R1.2 R5.2 TP1.1 U1.9), BUCK_CONVERTERS (5 pins), Contactor_Switching (6 pins)
GND: Connectors (15 pins), Power_Sensing (20 pins), BUCK_CONVERTERS (18 pins), Power_MCU (41 pins), VCU_Schematic (D17.2 JP5.3 JP6.3 R52.2), MCU_Signals (15 pins), CAN (C32.1 JP3.3 U7.2), Contactor_Switching (9 pins), ADC_Decoupling (12 pins), DAC (7 pins)
12V_GND: Connectors (X5.2), Power_Sensing (Q1.4)
12V_IN: Connectors (X5.1), Power_Sensing (Q1.1 R5.1 U1.8 U1.10)
AD1IN_0: Connectors (X1.3), VCU_Schematic (D17.1 U5.60), ADC_Decoupling (C33.2 R43#2.2)
AD1IN_7: Connectors (X1.4), VCU_Schematic (U5.61), ADC_Decoupling (C35.2 R39#2.2)
AD1IN_18: Connectors (X1.5), VCU_Schematic (U5.62), ADC_Decoupling (C41.2 R38#2.2)
AD1IN_19: Connectors (X2.8), VCU_Schematic (U5.63), ADC_Decoupling (C42.2 R55.2)
AD1IN_20: Connectors (X2.9), VCU_Schematic (U5.64), ADC_Decoupling (C34.2 R54.2)
AD1IN_21: Connectors (X2.10), VCU_Schematic (R52.1 U5.65), ADC_Decoupling (C36.2 R53.2)
BMS_UART_RX: Connectors (X2.19), VCU_Schematic (JP5.1 U5.131)
BMS_UART_TX: Connectors (X2.18), VCU_Schematic (JP5.2 U5.132)
CAN_H1: Connectors (X1.11 X2.17), CAN (5 pins)
CAN_L1: Connectors (X1.12 X2.16), CAN (5 pins)
DAC_OUTPUT: Connectors (X2.7), DAC (C38.2 R44.2 TP3.1 U8.4)
DCAN1_RX: VCU_Schematic (U5.90), CAN (R14.1 U7.4)
DCAN1_TX: VCU_Schematic (U5.89), CAN (R11.1 U7.1)
HET1_4: Connectors (X4.11), VCU_Schematic (U5.36)
HET1_5: Connectors (X4.5), VCU_Schematic (U5.31)
HET1_7: Connectors (X4.12), VCU_Schematic (U5.33)
HET1_9: Connectors (X4.3), VCU_Schematic (U5.35)
HET1_20: Connectors (X2.15), VCU_Schematic (U5.141)
HET1_25: Connectors (X4.4), VCU_Schematic (U5.37)
I2C_SCL: Connectors (X1.1), Power_Sensing (U1.5), VCU_Schematic (JP6.1 R6.1 R38#1.1 U5.3)
I2C_SDA: Connectors (X1.2), Power_Sensing (U1.4), VCU_Schematic (JP6.2 R7.1 R37.1 U5.4)
K1-: Connectors (X2.2), Contactor_Switching (D5.2 Q4.2 Q4.4 Z1.2)
K1_EN: VCU_Schematic (U5.16), Contactor_Switching (Q4.1 R19.2 R27.2)
K2-: Connectors (X2.4), Contactor_Switching (D7.2 Q5.2 Q5.4 Z2.2)
K2_EN: VCU_Schematic (U5.22), Contactor_Switching (Q5.1 R28.2 R39#1.2)
K3-: Connectors (X2.6), Contactor_Switching (D9.2 Q6.2 Q6.4 Z3.2)
K3_EN: VCU_Schematic (U5.14), Contactor_Switching (Q6.1 R29.2 R43#1.2)
MD_EN: Connectors (R9.2 R18.1 X1.6), VCU_Schematic (U5.9)
MIBSPI1_CLK: VCU_Schematic (U5.95), DAC (J1.2 U8.9)
MIBSPI1_MISO: VCU_Schematic (U5.94), DAC (J1.4 R49.1 R50.2)
MIBSPI1_MOSI: VCU_Schematic (U5.93), DAC (J1.3 U8.10)
MIBSPI1_NCS_0: VCU_Schematic (U5.105), DAC (J1.1 U8.2)
MIBSPI3_CLK: Connectors (X1.15), VCU_Schematic (J2.2 U5.53)
MIBSPI3_MISO: Connectors (X1.13), VCU_Schematic (J2.4 U5.51)
MIBSPI3_MOSI: Connectors (X1.14), VCU_Schematic (J2.3 U5.52)
MIBSPI3_NCS_0: Connectors (X1.16), VCU_Schematic (J2.1 U5.55)
SCI_RX: VCU_Schematic (U5.38), MCU_Signals (U9.15)
SCI_TX: VCU_Schematic (U5.39), MCU_Signals (U9.2)
WATCHDOG: VCU_Schematic (U5.30), MCU_Signals (U10.4)